# Altium schematic sheet CAN.SchDoc
size A4
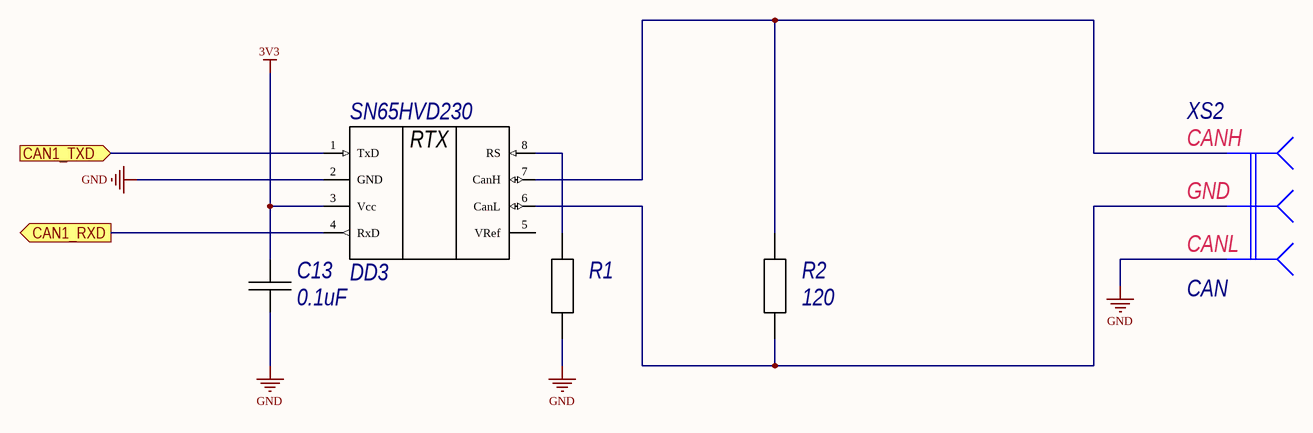
[diagram p0: CAN.SchDoc]

## Parts
C13  0.1uF  [C0805C]
DD3  SN65HVD230  [SOIC8 (SO-8)]
R1  R0805  [C0805R]  (value not drawn)
R2  120  [C0805R]
XS2  CAN  [YX-XH-3]

## Ports
CAN1_RXD (out), CAN1_TXD (in)

## Nets
3V3: C13.2 DD3.3(Vcc)
GND: C13.1 DD3.2(GND) R1.2 XS2.3
CAN1_RXD: DD3.4(RxD) ; port CAN1_RXD
CAN1_TXD: DD3.1(TxD) ; port CAN1_TXD
NetDD3_6: DD3.6(CanL) R2.2 XS2.2
NetDD3_7: DD3.7(CanH) R2.1 XS2.1
NetDD3_8: DD3.8(RS) R1.1

Not connected (* = marked no-connect by the designer): DD3 5(VRef)

## Notes on the sheet
- (in symbol CONNECT_CAN) CANH; GND; CANL
- (in symbol SN65HVD230) RTX

## Library data of the parts
C13 = CAP_0805: Type: Конденсатор; Published: 18.05.2010; Publisher: Andrew Danich
DD3 = SN65HVD230: Высокоскоростной CAN-Трансивер, 1Мб/с, 12В/24В, до 112 узлов; Published: 26.02.2013; Publisher: Andrew Danich; Type: Микросхема
R2 = R0805: Published: 24.03.2010; Publisher: Andrew Danich; Type: Резистор
XS2 = CONNECT_CAN: Published: 07.03.2013; Publisher: Andrew Danich; Type: Розетка
R1 = R0805: Published: 24.03.2010; Publisher: Andrew Danich; Type: Резистор